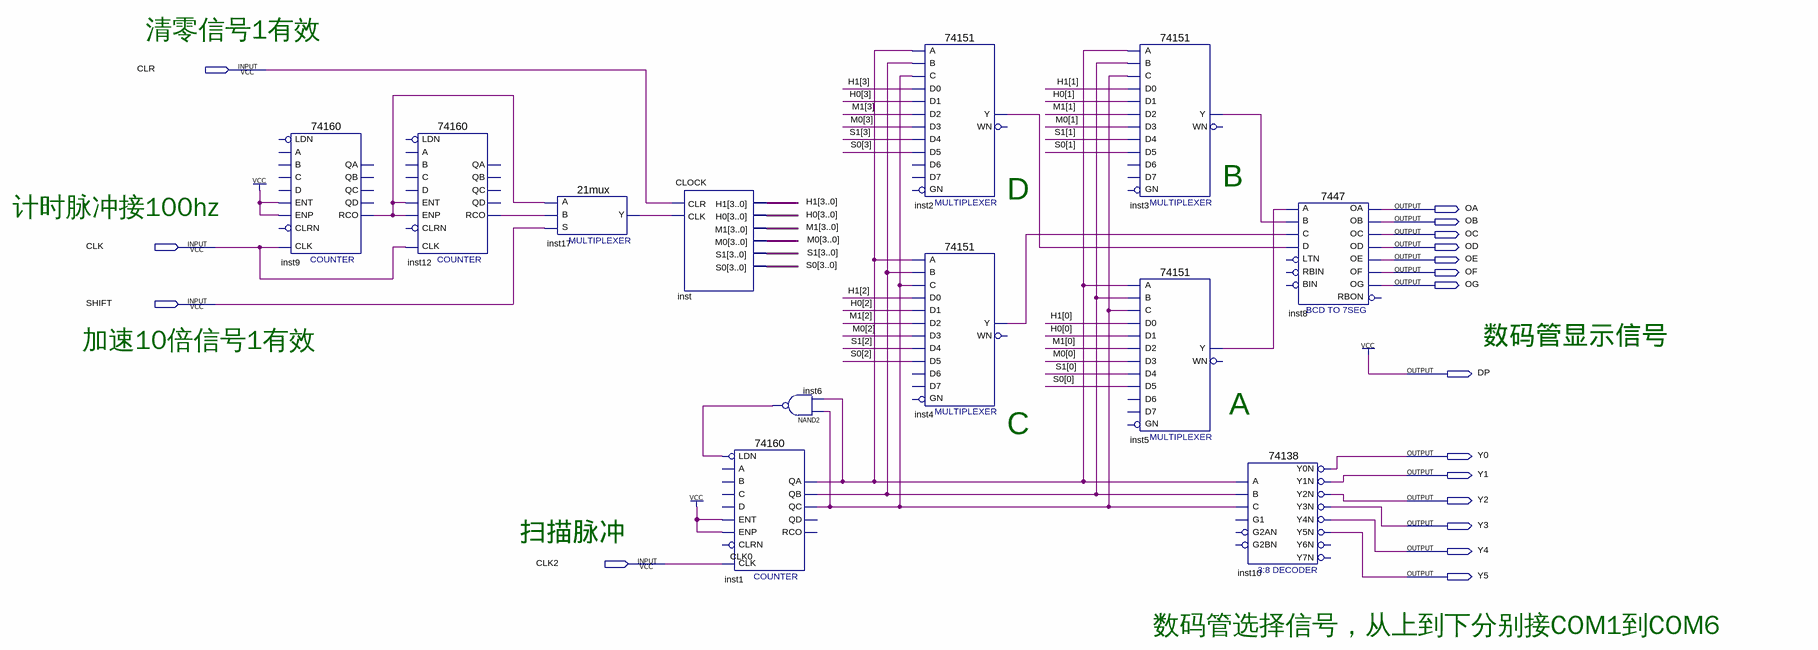
[diagram p0: schematic sheet]
// Quartus schematic shuzishizhong.bdf as structural Verilog: 12 symbols, 18 pins
module shuzishizhong (
  input  CLR,
  input  CLK,
  input  SHIFT,
  input  CLK2,
  output OA,
  output OB,
  output OC,
  output OD,
  output OE,
  output OF,
  output OG,
  output DP,
  output Y0,
  output Y1,
  output Y2,
  output Y3,
  output Y4,
  output Y5
);

  wire inst1_qa, inst1_qb, inst1_qc, inst2_y, inst3_y, inst4_y, inst5_y, inst6_out, inst9_rco, inst12_rco,
       inst17_y;
  wire [3:0] H0, H1, M0, M1, S0, S1;

  \74160  inst9 (.CLK(CLK), .ENT(1'b1), .ENP(1'b1), .RCO(inst9_rco));  // open: A, B, C, D, LDN, CLRN, QD, QA, QB, QC
  \74160  inst12 (
    .CLK(CLK), .ENT(inst9_rco), .ENP(inst9_rco), .RCO(inst12_rco));  // open: A, B, C, D, LDN, CLRN, QD, QA, QB, QC
  \21mux  inst17 (.S(SHIFT), .B(inst12_rco), .A(inst9_rco), .Y(inst17_y));
  CLOCK inst (.CLR(CLR), .CLK(inst17_y), .H1(H1), .H0(H0), .M1(M1), .M0(M0), .S1(S1), .S0(S0));
  \74160  inst1 (
    .CLK(CLK2), .ENT(1'b1), .LDN(inst6_out), .ENP(1'b1), .QA(inst1_qa), .QB(inst1_qb), .QC(inst1_qc));  // open: A, B, C, D, CLRN, QD, RCO
  nand inst6 (inst6_out, inst1_qc, inst1_qa);
  \74151  inst2 (
    .C(inst1_qc), .B(inst1_qb), .A(inst1_qa), .D5(S0[3]), .D0(H1[3]), .D1(H0[3]), .D4(S1[3]), .D3(M0[3]),
    .D2(M1[3]), .Y(inst2_y));  // open: GN, D6, D7, WN
  \74151  inst4 (
    .C(inst1_qc), .B(inst1_qb), .A(inst1_qa), .D5(S0[2]), .D0(H1[2]), .D1(H0[2]), .D4(S1[2]), .D3(M0[2]),
    .D2(M1[2]), .Y(inst4_y));  // open: GN, D6, D7, WN
  \74151  inst3 (
    .C(inst1_qc), .B(inst1_qb), .A(inst1_qa), .D5(S0[1]), .D0(H1[1]), .D1(H0[1]), .D4(S1[1]), .D3(M0[1]),
    .D2(M1[1]), .Y(inst3_y));  // open: GN, D6, D7, WN
  \74151  inst5 (
    .C(inst1_qc), .B(inst1_qb), .A(inst1_qa), .D5(S0[0]), .D0(H1[0]), .D1(H0[0]), .D4(S1[0]), .D3(M0[0]),
    .D2(M1[0]), .Y(inst5_y));  // open: GN, D6, D7, WN
  \74138  inst10 (
    .A(inst1_qa), .B(inst1_qb), .C(inst1_qc), .Y0N(Y0), .Y1N(Y1), .Y2N(Y2), .Y3N(Y3), .Y4N(Y4), .Y5N(Y5));  // open: G1, G2AN, G2BN, Y6N, Y7N
  \7447  inst8 (
    .B(inst3_y), .C(inst4_y), .D(inst2_y), .A(inst5_y), .OB(OB), .OC(OC), .OE(OE), .OD(OD), .OF(OF), .OG(OG),
    .OA(OA));  // open: LTN, RBIN, BIN, RBON

  assign DP = 1'b1;

  // Other names for the same wires on the sheet: CLK0 = CLK2

  // Notes on the sheet:
  //   清零信号1有效
  //   B
  //   D
  //   计时脉冲接100hz
  //   数码管显示信号
  //   加速10倍信号1有效
  //   A
  //   C
  //   扫描脉冲
  //   数码管选择信号，从上到下分别接COM1到COM6
endmodule
